# Altium schematic sheet Schematic_STM32.SchDoc
size A3; SheetNumber: 1; SheetTotal: 1
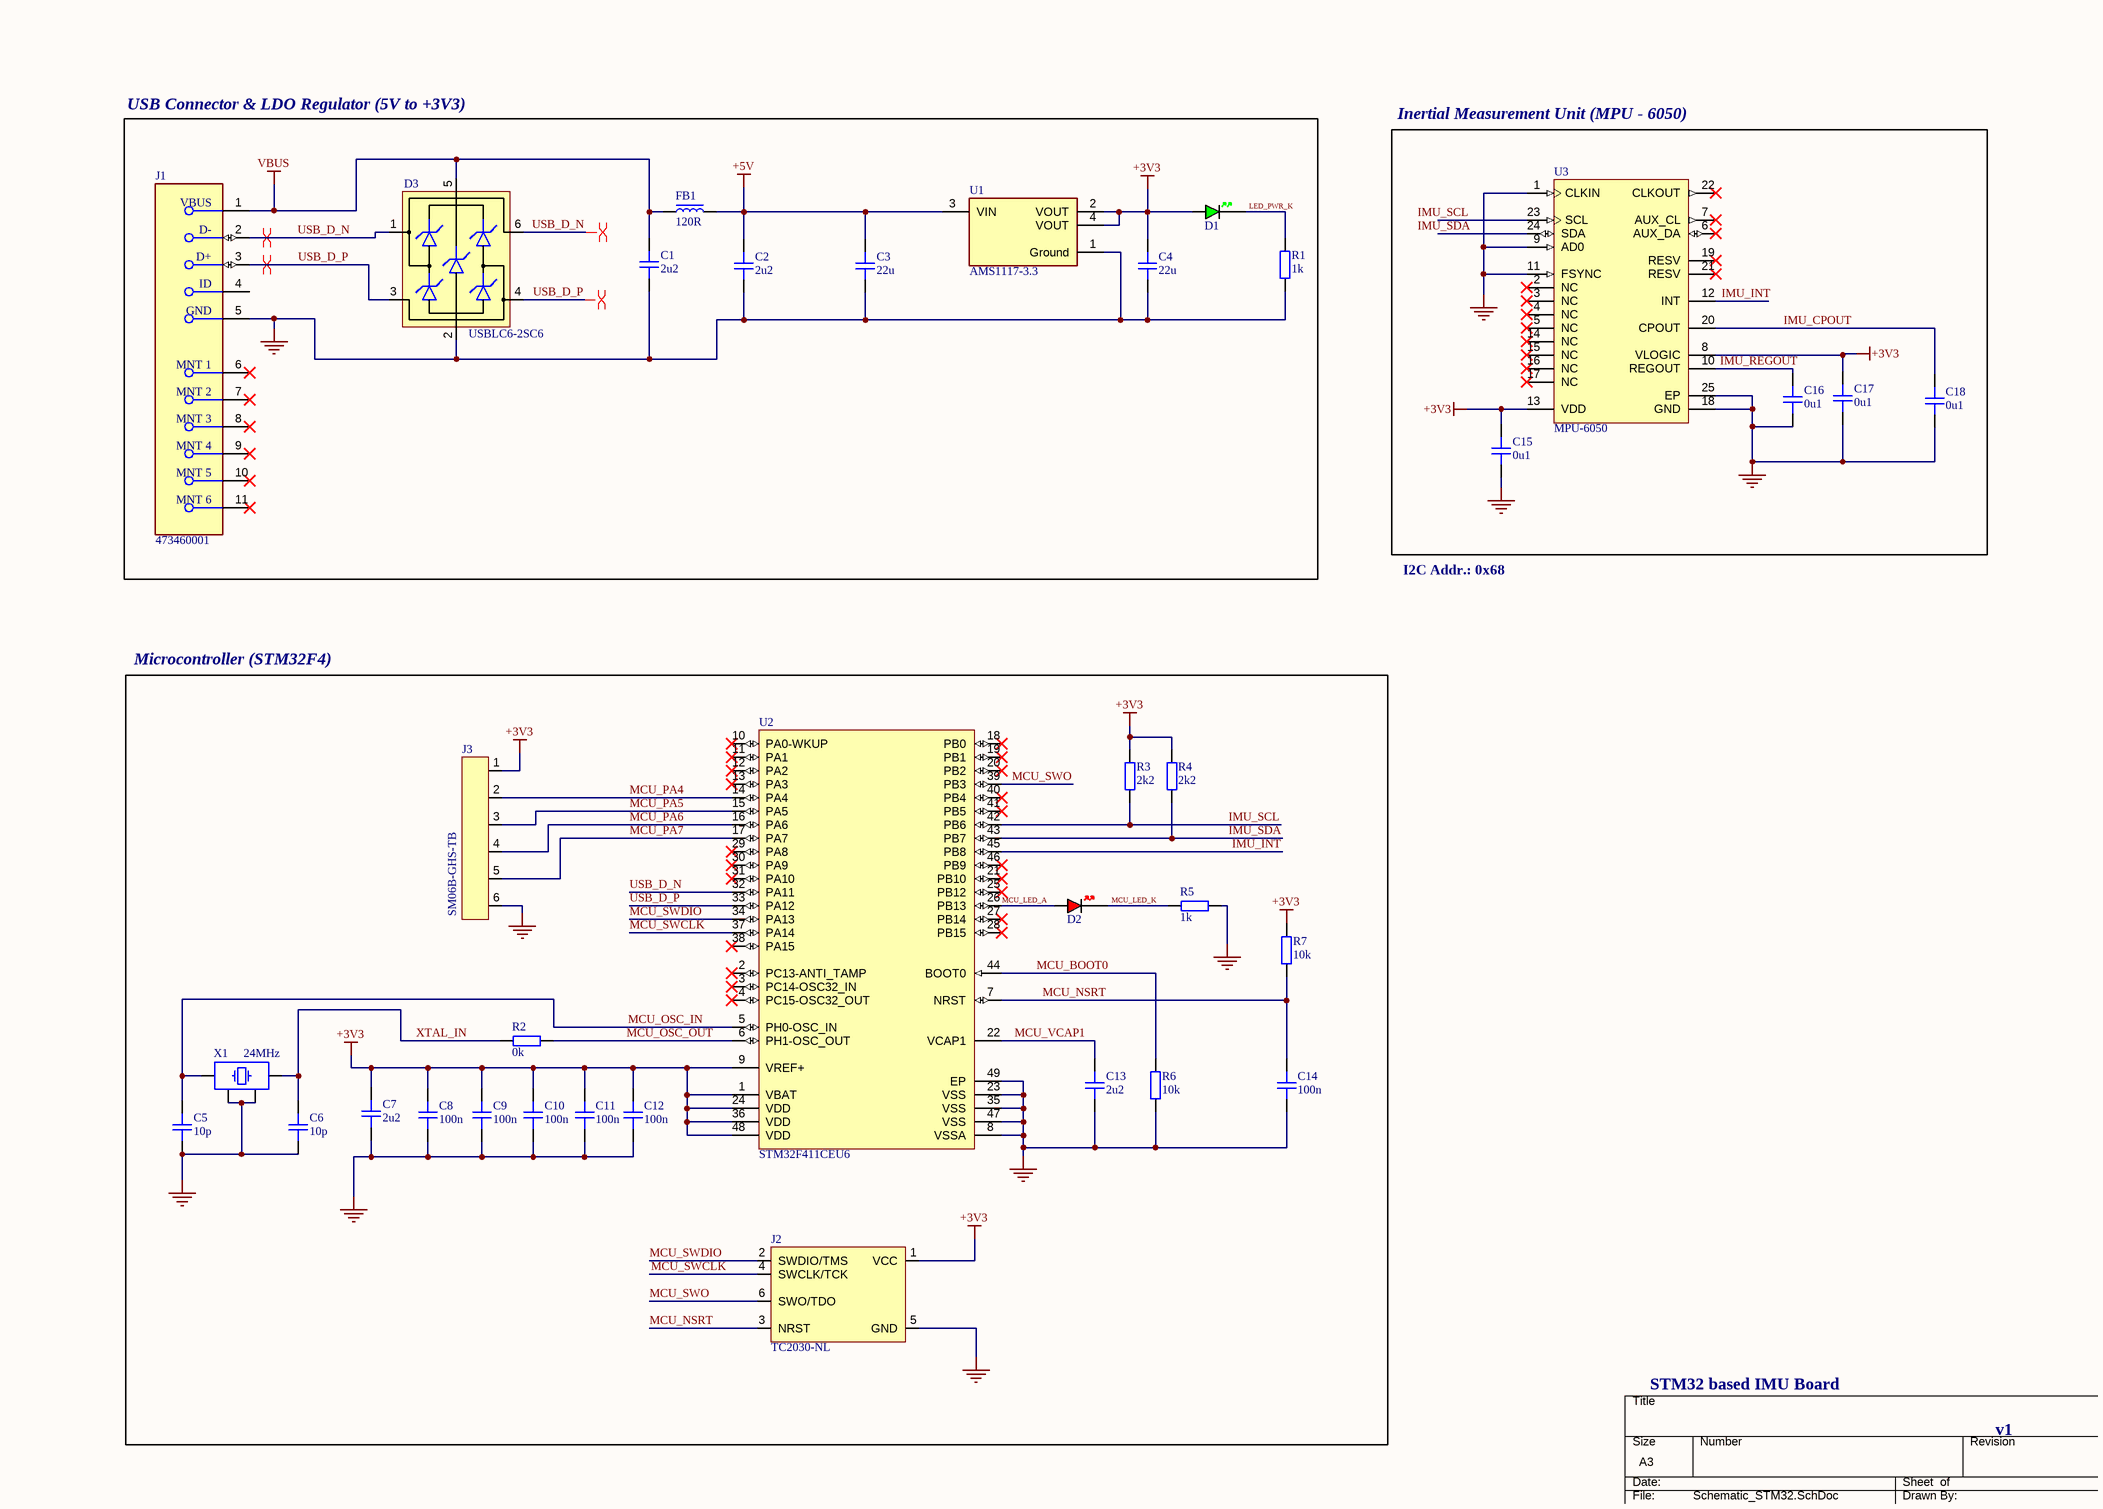
[diagram p0: Schematic_STM32.SchDoc]

## Parts
C1  2u2  [CAP_0603]
C2  2u2  [CAP_0603]
C3  22u  [CAP_0805]
C4  22u  [CAP_0805]
C5  10p  [CAP_0402]
C6  10p  [CAP_0402]
C7  2u2  [CAP_0603]
C8  100n  [CAP_0402]
C9  100n  [CAP_0402]
C10  100n  [CAP_0402]
C11  100n  [CAP_0402]
C12  100n  [CAP_0402]
C13  2u2  [CAP_0603]
C14  100n  [CAP_0402]
C15  0u1  [CAP_0402]
C16  0u1  [CAP_0402]
C17  0u1  [CAP_0402]
C18  0u1  [CAP_0402]
D1  GREEN  [LED_0402_GREEN]  (value not drawn)
D2  RED  [LED_0402_RED]  (value not drawn)
D3  USBLC6-2SC6  [SOT-23-6]
FB1  120R  [FB_0402]
J1  473460001  [FP-473460001-MFG]
J2  TC2030-NL  [TC2030-NL-FP]  (no BOM)
J3  SM06B-GHS-TB  [SM06B-GHS-TB]
R1  1k  [RES_0402]
R2  0k  [RES_0402]
R3  2k2  [RES_0402]
R4  2k2  [RES_0402]
R5  1k  [RES_0402]
R6  10k  [RES_0402]
R7  10k  [RES_0402]
U1  AMS1117-3.3  [FP-AMS1117-IPC_C]
U2  STM32F411CEU6  [STM-UFQFPN48_L]
U3  MPU-6050  [IS-QFN-24_V]
X1  24MHz  [XTAL_3225]

## Blocks framed on the sheet
USB Connector & LDO Regulator (5V to +3V3): C1-C4 D1 D3 FB1 J1 R1 U1
Inertial Measurement Unit (MPU - 6050): C15-C18 U3
Microcontroller (STM32F4): C5-C14 D2 J2 J3 R2-R7 U2 X1

## Nets
+3V3: C4.2 C7.2 C8.2 C9.2 C10.2 C11.2 C12.2 C15.2 C17.2 D1.A J2.1(VCC) J3.1 R3.2 R4.2 R7.2 U1.2(VOUT) U1.4(VOUT) U2.1(VBAT) U2.9(VREF+) U2.24(VDD) U2.36(VDD) U2.48(VDD) U3.8(VLOGIC) U3.13(VDD)
+5V: C2.2 C3.2 FB1.2 U1.3(VIN)
GND: C1.1 C2.1 C3.1 C4.1 C5.1 C6.1 C7.1 C8.1 C9.1 C10.1 C11.1 C12.1 C13.1 C14.1 C15.1 C16.1 C17.1 C18.1 D3.2(GND) J1.5(GND) J2.5(GND) J3.6 R1.1 R5.1 R6.1 U1.1(Ground) U2.8(VSSA) U2.23(VSS) U2.35(VSS) U2.47(VSS) U2.49(EP) U3.1(CLKIN) U3.9(AD0) U3.11(FSYNC) U3.18(GND) U3.25(EP) X1.2 X1.4
VBUS: C1.2 D3.5(VBUS) FB1.1 J1.1(VBUS)
IMU_CPOUT: C18.2 U3.20(CPOUT)
IMU_INT: U2.45(PB8) U3.12(INT)
IMU_REGOUT: C16.2 U3.10(REGOUT)
IMU_SCL: R3.1 U2.42(PB6) U3.23(SCL)
IMU_SDA: R4.1 U2.43(PB7) U3.24(SDA)
LED_PWR_K: D1.K R1.2
MCU_BOOT0: R6.2 U2.44(BOOT0)
MCU_LED_A: D2.A U2.26(PB13)
MCU_LED_K: D2.K R5.2
MCU_NSRT: C14.2 J2.3(NRST) R7.1 U2.7(NRST)
MCU_OSC_IN: C5.2 U2.5(PH0-OSC_IN) X1.1
MCU_OSC_OUT: R2.1 U2.6(PH1-OSC_OUT)
MCU_PA4: J3.2 U2.14(PA4)
MCU_PA5: J3.3 U2.15(PA5)
MCU_PA6: J3.4 U2.16(PA6)
MCU_PA7: J3.5 U2.17(PA7)
MCU_SWCLK: J2.4(SWCLK/TCK) U2.37(PA14)
MCU_SWDIO: J2.2(SWDIO/TMS) U2.34(PA13)
MCU_SWO: J2.6(SWO/TDO) U2.39(PB3)
MCU_VCAP1: C13.2 U2.22(VCAP1)
USB_D_N: D3.1(IO1) D3.6(IO1) J1.2(D-) U2.32(PA11)
USB_D_P: D3.3(IO2) D3.4(IO2) J1.3(D+) U2.33(PA12)
XTAL_IN: C6.2 R2.2 X1.3

Not connected (* = marked no-connect by the designer): J1 4(ID) 6(MNT_1)* 7(MNT_2)* 8(MNT_3)* 9(MNT_4)* 10(MNT_5)* 11(MNT_6)*; U2 2(PC13-ANTI_TAMP)* 3(PC14-OSC32_IN)* 4(PC15-OSC32_OUT)* 10(PA0-WKUP)* 11(PA1)* 12(PA2)* 13(PA3)* 18(PB0)* 19(PB1)* 20(PB2)* 21(PB10)* 25(PB12)* 27(PB14)* 28(PB15)* 29(PA8)* 30(PA9)* 31(PA10)* 38(PA15)* 40(PB4)* 41(PB5)* 46(PB9)*; U3 2(NC)* 3(NC)* 4(NC)* 5(NC)* 6(AUX_DA)* 7(AUX_CL)* 14(NC)* 15(NC)* 16(NC)* 17(NC)* 19(RESV)* 21(RESV)* 22(CLKOUT)*

## Layout directives
differential pair: USB_D_N, USB_D_P

## Notes on the sheet
- I2C Addr.: 0x68
- STM32 based IMU Board
- v1

## Library data of the parts
C1 C2 C7 C13 = CAP_0603: Capacitor SMD 0603; Manufacturer: *; Manufacturer Part Number: *; Distributor Link: *; LCSC: *; Rating: *; Dielectric: *
C3 C4 = CAP_0805: Capacitor SMD 0805; Manufacturer: *; Manufacturer Part Number: *; Distributor Link: *; LCSC: *; Rating: *; Dielectric: *
C5 C6 C8-C12 C14-C18 = CAP_0402: Capacitor SMD 0402; Manufacturer: *; Manufacturer Part Number: *; Distributor Link: *; LCSC: *; Rating: *; Dielectric: *
D1 = LED_0402_GREEN: LED 0402 GREEN SMD
D2 = LED_0402_RED: LED 0402 RED SMD
D3 = USBLC6-2SC6: Low-Capacitance ESD Protection USB; Manufacturer: STMicroelectronics; Manufacturer Part Number: USBLC6-2SC6; Distributor Link: https://www.mouser.de/ProductDetail/STMicroelectronics/USBLC6-2SC6?qs=po45yt2pPpu%2FhNIlwQdTlg%3D%3D
FB1 = FB_0402: Ferrite Bead SMD 0402; Manufacturer: *; Manufacturer Part Number: *; Distributor Link: *; LCSC: *
J1 = CMP-2000-05246-2: CONN RCPT USB2.0 MICRO B SMD R/A; Manufacturer: Molex; Conn Orientation: Right Angle; Is Female: yes; Shielding: true; Pitch: 0.65mm; Number Of Contacts: 5; Voltage Rating: 30V; Current Rating: 1.8A; Device Class L2: USB Connectors; Digikey Description: CONN RCPT USB2.0 MICRO B SMD R/A; Height: 2.945mm; RoHS: TRUE; ComponentLink2Description: Datasheet; Octopart: https://octopart.com/47346-0001-molex-7164928; Automotive: No; Package: 0; Category: Conn; Device Class L1: Connectors; Usb Standard: USB 2.0; Temperature: -30°C to +85°C; Temperature Range Low: -30°C; Footprint Url: https://www.molex.com/pdm_docs/sd/473460001_sd.pdf; ComponentLink2URL: https://www.molex.com/webdocs/datasheets/pdf/en-us/0473460001_IO_CONNECTORS.pdf; Lead Free: Yes; Manufacturer Part Number: 473460001; Contact Material: Gold,Nickel; Temperature Range High: +85°C; Device Class L3: unset
J2 = TC2030-NL: Tag-Connect No-Solder SWD Debug Connector (No Legs) DO NOT PLACE; Manufacturer: Tag-Connect; Manufacturer Part Number: TC2030-NL-FP
J3 = SM06B-GHS-TB: Header Connector 6 Position 1.25MM Pitch SMD Horizontal JST GH; Manufacturer: JST; Manufacturer Part Number: SM06B-GHS-TB
R1-R7 = RES_0402: Resistor SMD 0402; Manufacturer: *; Manufacturer Part Number: *; Distributor Link: *; LCSC: *
U1 = CMP-209535-000001-1: LDO Voltage Regulators 1A, 3.3V; Manufacturer: Advanced Monolithic Systems; Dropout Voltage: 1.1V; Output Type: Fixed; Nominal Supply Current: 5mA; Max Power Dissipation: 1.2W; Max Supply Voltage: 15V; Number Of Outputs: 1; Standoff Height: 0.64mm; Max Junction Temp: +125°C; Height: 1.8mm; Package: AMS1117; Device Class L2: Power Management ICs; ComponentLink2Description: Datasheet; ComponentLink2URL: http://www.advanced-monolithic.com/pdf/ds1117.pdf; Category: IC; RoHS: TRUE; Automotive: No; Device Class L1: Integrated Circuits (ICs); Output Current: 1A; Device Class L3: Voltage Regulators - Linear; Temperature: -40°C to +125°C; Output Voltage: 3.3V; Manufacturer Part Number: AMS1117-3.3; Temperature Range Low: -40°C; Octopart: https://octopart.com/ams1117-3.3-advanced+monolithic+systems-25899300; Lead Free: Yes; Ipc Land Pattern Name: SOT229P700X180-4; Temperature Range High: +125°C
U2 = CMP-0243-00165-1: ARM Cortex-M4 32-bit MCU+FPU, 512 KB Flash, 128 KB RAM, 36 I/Os, 48-Pin UFQFPN, -40 to 85 degC, Tray; Operating Frequency(F) (Processor speed) (MHz): 100; FLASH Size (Prog) (kB): 512; Internal RAM Size (kB): 128; I/Os (High Current): 36; Supply Voltage(Vcc) min (V): 1.7; Package Reference: 48-Pin Ultra Thin Fine Pitch Quad Flat No-Lead, 7 x 7 x 0.6 mm Body, 0.5 mm Pitch, Exposed Pad; ComponentLink1Description: Manufacturer URL; ComponentLink1URL: http://www.st.com/; Packing: Tray; Package Description: UFQFPN48; Core: ARM Cortex-M4; ComponentLink2Description: Datasheet; ComponentLink2URL: http://www.st.com/st-web-ui/static/active/en/resource/technical/document/datasheet/DM00115249.pdf; DatasheetVersion: Rev. 6; Mounting Technology: Surface Mount
U3 = CMP-1753-00002-2: 3-Axis Gyroscope, Accelerometer and a Digital Motion Processor(TM) (DMP), 2.375 to 3.46 V, -40 to 85 degC, 24-Pin QFN, RoHS, Tape and Reel; Manufacturer: InvenSense; Featured Product: MPU-60506-Axis,IntegratedI²CSolution; Other Names: 1428-1007-2 / MPU6050; Sensor Type: MotionTracking; Online Catalog: MPU-6000™Series; Unit PriceUSD: Digital; Datasheet Version: Rev. 3.3, 05/2012; Category: Sensors,Transducers; Datasheet URL: http://datasheet.octopart.com/MPU-6050-InvenSense-datasheet-14421344.pdf; Family: Multifunction; Standard Package: 5,000; Manufacturer URL: http://www.invensense.com/; Output Type: Digital; Dynamic Catalog: MPU-6000™Series
X1 = TSX-3225_24.0000MF15X-AC: Crystal SMD 24MHz 10PPM 7pF 3225; Manufacturer: Epson; Manufacturer Part Number: TSX-3225 24.0000MF15X-AC